# Altium schematic sheet TPriiorityEncoder.SchDoc
size A4
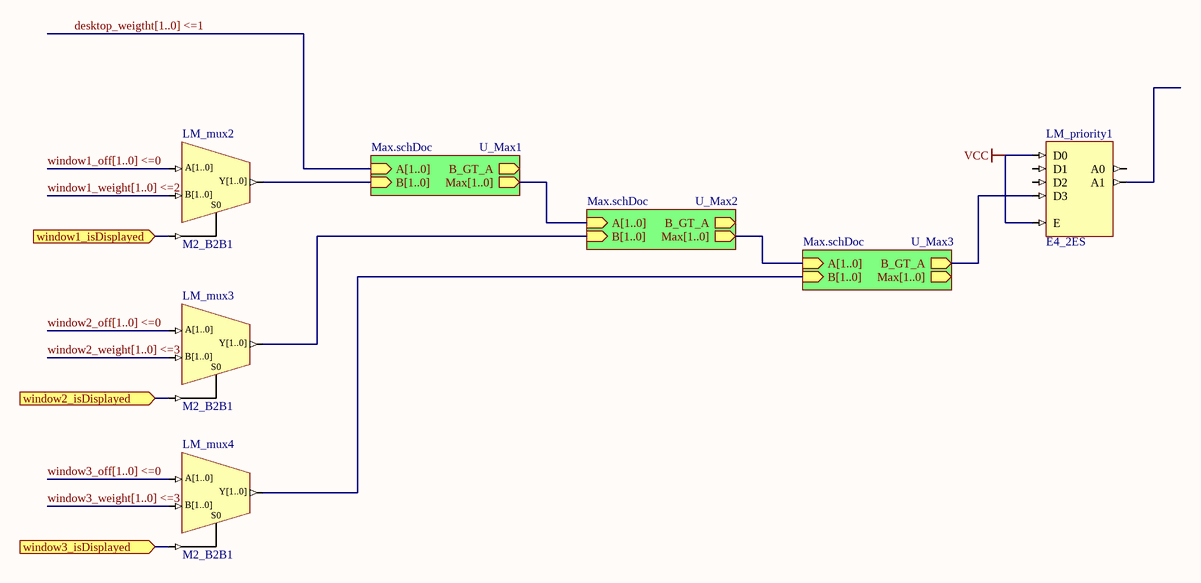
[diagram p0: TPriiorityEncoder.SchDoc]

## Parts
LM_mux2  M2_B2B1
LM_mux3  M2_B2B1
LM_mux4  M2_B2B1
LM_priority1  E4_2ES

## Sub-sheets
U_Max1 = Max.schDoc: A[1..0] (in), B[1..0] (in), B_GT_A (out), Max[1..0] (out)
U_Max2 = Max.schDoc: A[1..0] (in), B[1..0] (in), B_GT_A (out), Max[1..0] (out)
U_Max3 = Max.schDoc: A[1..0] (in), B[1..0] (in), B_GT_A (out), Max[1..0] (out)

## Ports
window1_isDisplayed (in), window2_isDisplayed (in), window3_isDisplayed (in)

## Nets
VCC: LM_priority1.D0 LM_priority1.E
window1_isDisplayed: LM_mux2.S0 ; port window1_isDisplayed
window1_off[1..0] <=0: LM_mux2.A[1..0]
window1_weight[1..0] <=2: LM_mux2.B[1..0]
window2_isDisplayed: LM_mux3.S0 ; port window2_isDisplayed
window2_off[1..0] <=0: LM_mux3.A[1..0]
window2_weight[1..0] <=3: LM_mux3.B[1..0]
window3_isDisplayed: LM_mux4.S0 ; port window3_isDisplayed
window3_off[1..0] <=0: LM_mux4.A[1..0]
window3_weight[1..0] <=3: LM_mux4.B[1..0]
NetLM_mux2_Y[1..0]: LM_mux2.Y[1..0] ; sheet U_Max1/B[1..0]
NetLM_mux3_Y[1..0]: LM_mux3.Y[1..0] ; sheet U_Max2/B[1..0]
NetLM_mux4_Y[1..0]: LM_mux4.Y[1..0] ; sheet U_Max3/B[1..0]
NetLM_priority1_D3: LM_priority1.D3 ; sheet U_Max3/B_GT_A

Not connected (* = marked no-connect by the designer): LM_priority1 A0 A1 D1 D2

## Buses and harness runs
bus desktop_weigtht[1..0] <=1 = sheet U_Max1/A[1..0]
bus sheet U_Max1/Max[1..0] = sheet U_Max2/A[1..0]
bus sheet U_Max2/Max[1..0] = sheet U_Max3/A[1..0]
bus window1_off[1..0] <=0
bus window1_weight[1..0] <=2
bus window2_off[1..0] <=0
bus window2_weight[1..0] <=3
bus window3_off[1..0] <=0
bus window3_weight[1..0] <=3

## Library data of the parts
LM_mux2-LM_mux4 = M2_B2B1: 2x2-Bit Bus to 1x2-Bit Bus Multiplexer; ArchiveName: GENERIC; Published: 9-30-2003; Publisher: Altium Limited; Core Revision: 1.00.00
LM_priority1 = E4_2ES: 4- to 2-Bit Priority Encoder with Enable, Single Pin Version; ArchiveName: GENERIC; Published: 9-30-2003; Publisher: Altium Limited; Core Revision: 1.00.00